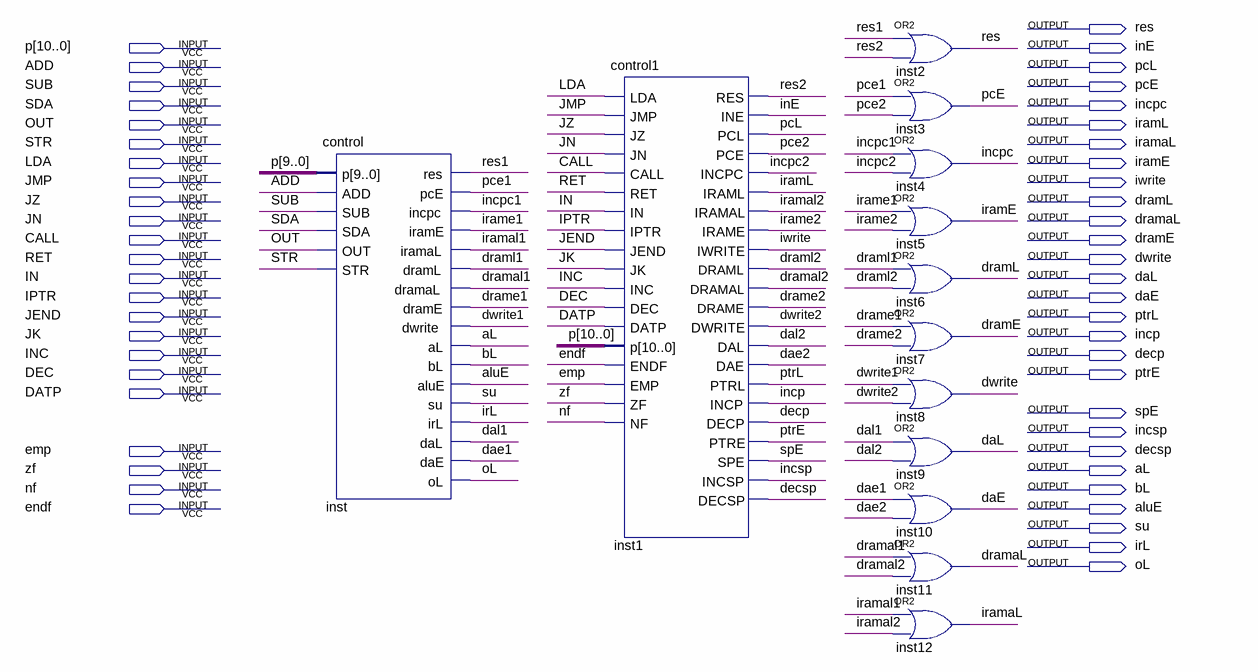
[diagram p0: schematic sheet]
// Quartus schematic ctrl.bdf as structural Verilog: 13 symbols, 51 pins
module ctrl (
  input  [10:0] p,
  input  ADD,
  input  SUB,
  input  SDA,
  input  OUT,
  input  STR,
  input  LDA,
  input  JMP,
  input  JZ,
  input  JN,
  input  CALL,
  input  RET,
  input  IN,
  input  IPTR,
  input  JEND,
  input  JK,
  input  INC,
  input  DEC,
  input  DATP,
  input  emp,
  input  zf,
  input  nf,
  input  endf,
  output res,
  output inE,
  output pcL,
  output pcE,
  output incpc,
  output iramL,
  output iramaL,
  output iramE,
  output iwrite,
  output dramL,
  output dramaL,
  output dramE,
  output dwrite,
  output daL,
  output daE,
  output ptrL,
  output incp,
  output decp,
  output ptrE,
  output spE,
  output incsp,
  output decsp,
  output aL,
  output bL,
  output aluE,
  output su,
  output irL,
  output oL
);

  wire dae1, dae2, dal1, dal2, dramal1, dramal2, drame1, drame2, draml1, draml2, dwrite1, dwrite2, incpc1,
       incpc2, iramal1, iramal2, irame1, irame2, pce1, pce2, res1, res2;

  control inst (
    .p(p[9:0]), .ADD(ADD), .SUB(SUB), .SDA(SDA), .OUT(OUT), .STR(STR), .res(res1), .pcE(pce1),
    .incpc(incpc1), .iramE(irame1), .iramaL(iramal1), .dramL(draml1), .dramaL(dramal1), .dramE(drame1),
    .dwrite(dwrite1), .aL(aL), .bL(bL), .aluE(aluE), .su(su), .irL(irL), .daL(dal1), .daE(dae1), .oL(oL));
  control1 inst1 (
    .LDA(LDA), .JMP(JMP), .JZ(JZ), .JN(JN), .CALL(CALL), .RET(RET), .IN(IN), .IPTR(IPTR), .JEND(JEND),
    .JK(JK), .INC(INC), .DEC(DEC), .DATP(DATP), .p(p), .ENDF(endf), .EMP(emp), .ZF(zf), .NF(nf), .RES(res2),
    .INE(inE), .PCL(pcL), .PCE(pce2), .INCPC(incpc2), .IRAML(iramL), .IRAMAL(iramal2), .IRAME(irame2),
    .IWRITE(iwrite), .DRAML(draml2), .DRAMAL(dramal2), .DRAME(drame2), .DWRITE(dwrite2), .DAL(dal2),
    .DAE(dae2), .PTRL(ptrL), .INCP(incp), .DECP(decp), .PTRE(ptrE), .SPE(spE), .INCSP(incsp), .DECSP(decsp));
  or inst2 (res, res1, res2);
  or inst3 (pcE, pce1, pce2);
  or inst4 (incpc, incpc1, incpc2);
  or inst5 (iramE, irame1, irame2);
  or inst6 (dramL, draml1, draml2);
  or inst7 (dramE, drame1, drame2);
  or inst8 (dwrite, dwrite1, dwrite2);
  or inst9 (daL, dal1, dal2);
  or inst10 (daE, dae1, dae2);
  or inst11 (dramaL, dramal1, dramal2);
  or inst12 (iramaL, iramal1, iramal2);
endmodule
